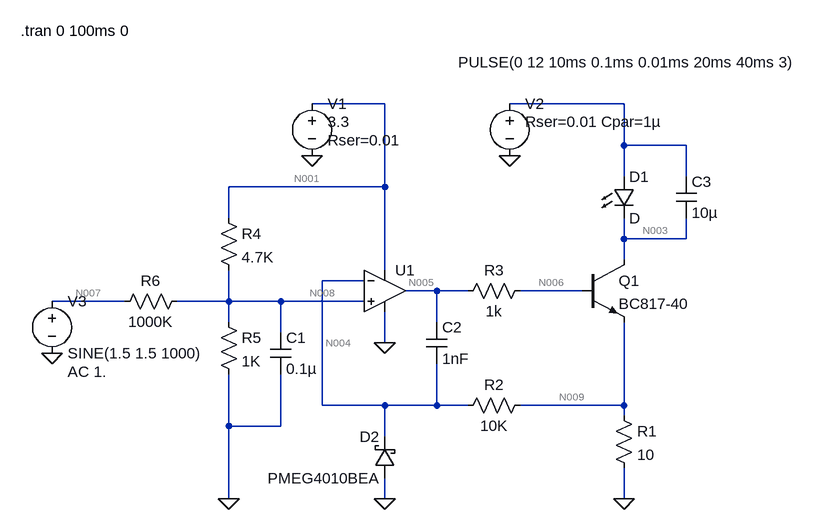
[diagram p0: schematic LDCurrentReg.asc]
LDCurrentReg.asc, the LTspice schematic file:
Version 4
SHEET 1 924 692
WIRE 160 -144 48 -144
WIRE 528 -144 352 -144
WIRE 528 -80 528 -144
WIRE 624 -80 528 -80
WIRE 528 -32 528 -80
WIRE 624 -32 624 -80
WIRE 160 -16 160 -144
WIRE 160 -16 -80 -16
WIRE -80 32 -80 -16
WIRE 528 64 528 32
WIRE 624 64 624 32
WIRE 624 64 528 64
WIRE 528 96 528 64
WIRE 160 112 160 -16
WIRE 128 128 64 128
WIRE 240 144 192 144
WIRE 288 144 240 144
WIRE 464 144 368 144
WIRE -240 160 -352 160
WIRE -80 160 -80 112
WIRE -80 160 -160 160
WIRE 0 160 -80 160
WIRE 128 160 0 160
WIRE -80 192 -80 160
WIRE 240 192 240 144
WIRE 0 208 0 160
WIRE 160 224 160 176
WIRE 64 320 64 128
WIRE 160 320 64 320
WIRE 240 320 240 256
WIRE 240 320 160 320
WIRE 288 320 240 320
WIRE 528 320 528 192
WIRE 528 320 368 320
WIRE 528 336 528 320
WIRE -80 352 -80 272
WIRE 0 352 0 272
WIRE 0 352 -80 352
WIRE 160 368 160 320
WIRE -80 464 -80 352
WIRE 160 464 160 432
WIRE 528 464 528 416
FLAG 528 464 0
FLAG 352 -64 0
FLAG 48 -64 0
FLAG 160 224 0
FLAG -80 464 0
FLAG -352 240 0
FLAG 160 464 0
SYMBOL res 512 320 R0
SYMATTR InstName R1
SYMATTR Value 10
SYMBOL LED 512 -32 R0
SYMATTR InstName D1
SYMBOL npn 464 96 R0
SYMATTR InstName Q1
SYMATTR Value BC817-40
SYMBOL res 384 304 R90
WINDOW 0 0 56 VBottom 2
WINDOW 3 32 56 VTop 2
SYMATTR InstName R2
SYMATTR Value 10K
SYMBOL OpAmps\\UniversalOpAmp2 160 144 R0
SYMATTR InstName U1
SYMATTR Value2 Avol=1Meg GBW=1Meg Slew=1Meg
SYMBOL res 384 128 R90
WINDOW 0 0 56 VBottom 2
WINDOW 3 32 56 VTop 2
SYMATTR InstName R3
SYMATTR Value 1k
SYMBOL voltage 48 -160 R0
WINDOW 3 24 44 Left 2
WINDOW 123 0 0 Left 0
WINDOW 39 24 72 Left 2
SYMATTR InstName V1
SYMATTR Value 3.3
SYMATTR SpiceLine Rser=0.01
SYMBOL voltage 352 -160 R0
WINDOW 3 -79 -48 Left 2
WINDOW 123 0 0 Left 0
WINDOW 39 24 44 Left 2
SYMATTR InstName V2
SYMATTR Value PULSE(0 12 10ms 0.1ms 0.01ms 20ms 40ms 3)
SYMATTR SpiceLine Rser=0.01 Cpar=1µ
SYMBOL res -96 16 R0
SYMATTR InstName R4
SYMATTR Value 4.7K
SYMBOL res -96 176 R0
SYMATTR InstName R5
SYMATTR Value 1K
SYMBOL cap -16 208 R0
SYMATTR InstName C1
SYMATTR Value 0.1µ
SYMATTR SpiceLine V=25 Irms=1.34 Rser=0.0989014 Lser=0 mfg="KEMET" pn="C0805C104K3RAC" type="X7R"
SYMBOL voltage -352 144 R0
WINDOW 123 24 124 Left 2
WINDOW 39 0 0 Left 0
SYMATTR InstName V3
SYMATTR Value SINE(1.5 1.5 1000)
SYMATTR Value2 AC 1.
SYMBOL res -144 144 R90
WINDOW 0 0 56 VBottom 2
WINDOW 3 32 56 VTop 2
SYMATTR InstName R6
SYMATTR Value 1000K
SYMBOL cap 224 192 R0
SYMATTR InstName C2
SYMATTR Value 1nF
SYMATTR SpiceLine V=50 Irms=270m Rser=0.379979 Lser=0
SYMBOL cap 608 -32 R0
SYMATTR InstName C3
SYMATTR Value 10µ
SYMATTR SpiceLine V=6.3 Irms=8.88 Rser=0.00522854 Lser=0
SYMBOL schottky 176 432 R180
WINDOW 0 24 64 Left 2
WINDOW 3 24 0 Left 2
SYMATTR InstName D2
SYMATTR Value PMEG4010BEA
TEXT -400 -256 Left 2 !.tran 0 100ms 0

The netlist it stands for:
* LDCurrentReg.asc
R1 N009 0 10
D1 N002 N003 D
Q1 N003 N006 N009 0 BC817-40
R2 N009 N004 10K
XU1 N008 N004 N001 0 N005 level2 Avol=1Meg GBW=1Meg Slew=1Meg Ilimit=25m Rail=0 Vos=0 En=0 Enk=0 In=0 Ink=0 Rin=500Meg  ; pins In+ In- V+ V- OUT
R3 N006 N005 1k
V1 N001 0 3.3 Rser=0.01
V2 N002 0 PULSE(0 12 10ms 0.1ms 0.01ms 20ms 40ms 3) Rser=0.01 Cpar=1µ
R4 N001 N008 4.7K
R5 N008 0 1K
C1 N008 0 0.1µ V=25 Irms=1.34 Rser=0.0989014 Lser=0 mfg="KEMET" pn="C0805C104K3RAC" type="X7R"
V3 N007 0 SINE(1.5 1.5 1000) AC 1.
R6 N008 N007 1000K
C2 N005 N004 1nF V=50 Irms=270m Rser=0.379979 Lser=0
C3 N002 N003 10µ V=6.3 Irms=8.88 Rser=0.00522854 Lser=0
D2 0 N004 PMEG4010BEA
.model D D
.lib standard.dio
.model NPN NPN
.model PNP PNP
.lib standard.bjt
.tran 0 100ms 0
.lib UniversalOpAmp2.lib
.backanno
.end

* Results of the author's LTspice run, read from the files saved beside the schematic
* Operating Point, zero values left out:
*   V(n009) = 25.38 mV
*   V(n003) = 29.02 mV
*   V(n006) = 734.5 mV
*   V(n004) = 13.64 mV
*   V(n005) = 3.274 V
*   V(n001) = 3.3 V
*   V(n008) = 579.7 mV
*   V(n007) = 1.5 V
*   Ib(Q1) = 2.539 mA
*   Ie(Q1) = -2.539 mA
*   I(D2) = -1.177 µA
*   I(R1) = 2.538 mA
*   I(R2) = 1.174 µA
*   I(R3) = -2.539 mA
*   I(R4) = 578.8 µA
*   I(R5) = 579.7 µA
*   I(R6) = -920.3 nA
*   I(V1) = -3.118 mA
*   I(V3) = -920.3 nA
*   Ix(u1:1) = -2.141 nA
*   Ix(u1:2) = -3.273 nA
*   Ix(u1:3) = 2.539 mA
*   Ix(u1:4) = -418.7 nA
*   Ix(u1:5) = -2.539 mA
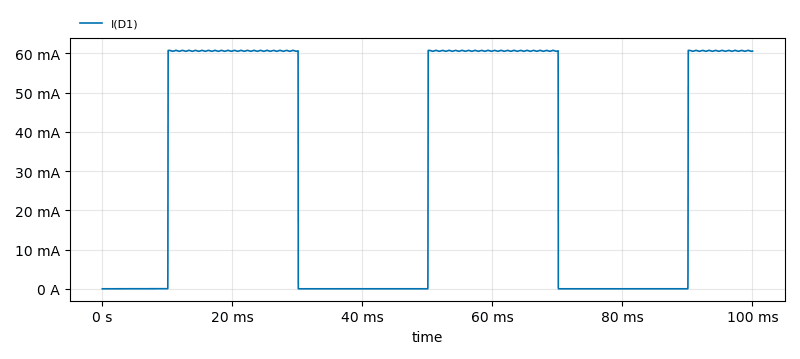
[diagram p1: Transient Analysis of LDCurrentReg.asc, plotted from the saved traces]
* Transient Analysis, 1 run:
*   I(D1): min 0 A, max 60.77 mA, average 30.3 mA, rms 42.86 mA, last 60.6 mA